# Altium schematic sheet PA_Channel.SchDoc: RF Channel
size 420 x 297 mm; Author: G.K.; CompanyName: WUT; DrawnBy: G.K.; Organization: WUT ISE; Address1: Warsaw Univeristy of Technology; Address2: Nowowiejska 15/19; Revision: -; SheetNumber: -; SheetTotal: -; EDA_Number: ARTIQ; Projet: 8 Channel RF Power Amplifier; ModifiedBy: -; CreateDate: XX/XX/XXXX; CheckedDate: -; Title2: Power supply & protection; DivGrp: ISE; Designer: G.K.; ModifiedDate: -; ProjectName: 8 Channel RF Power Amplifier
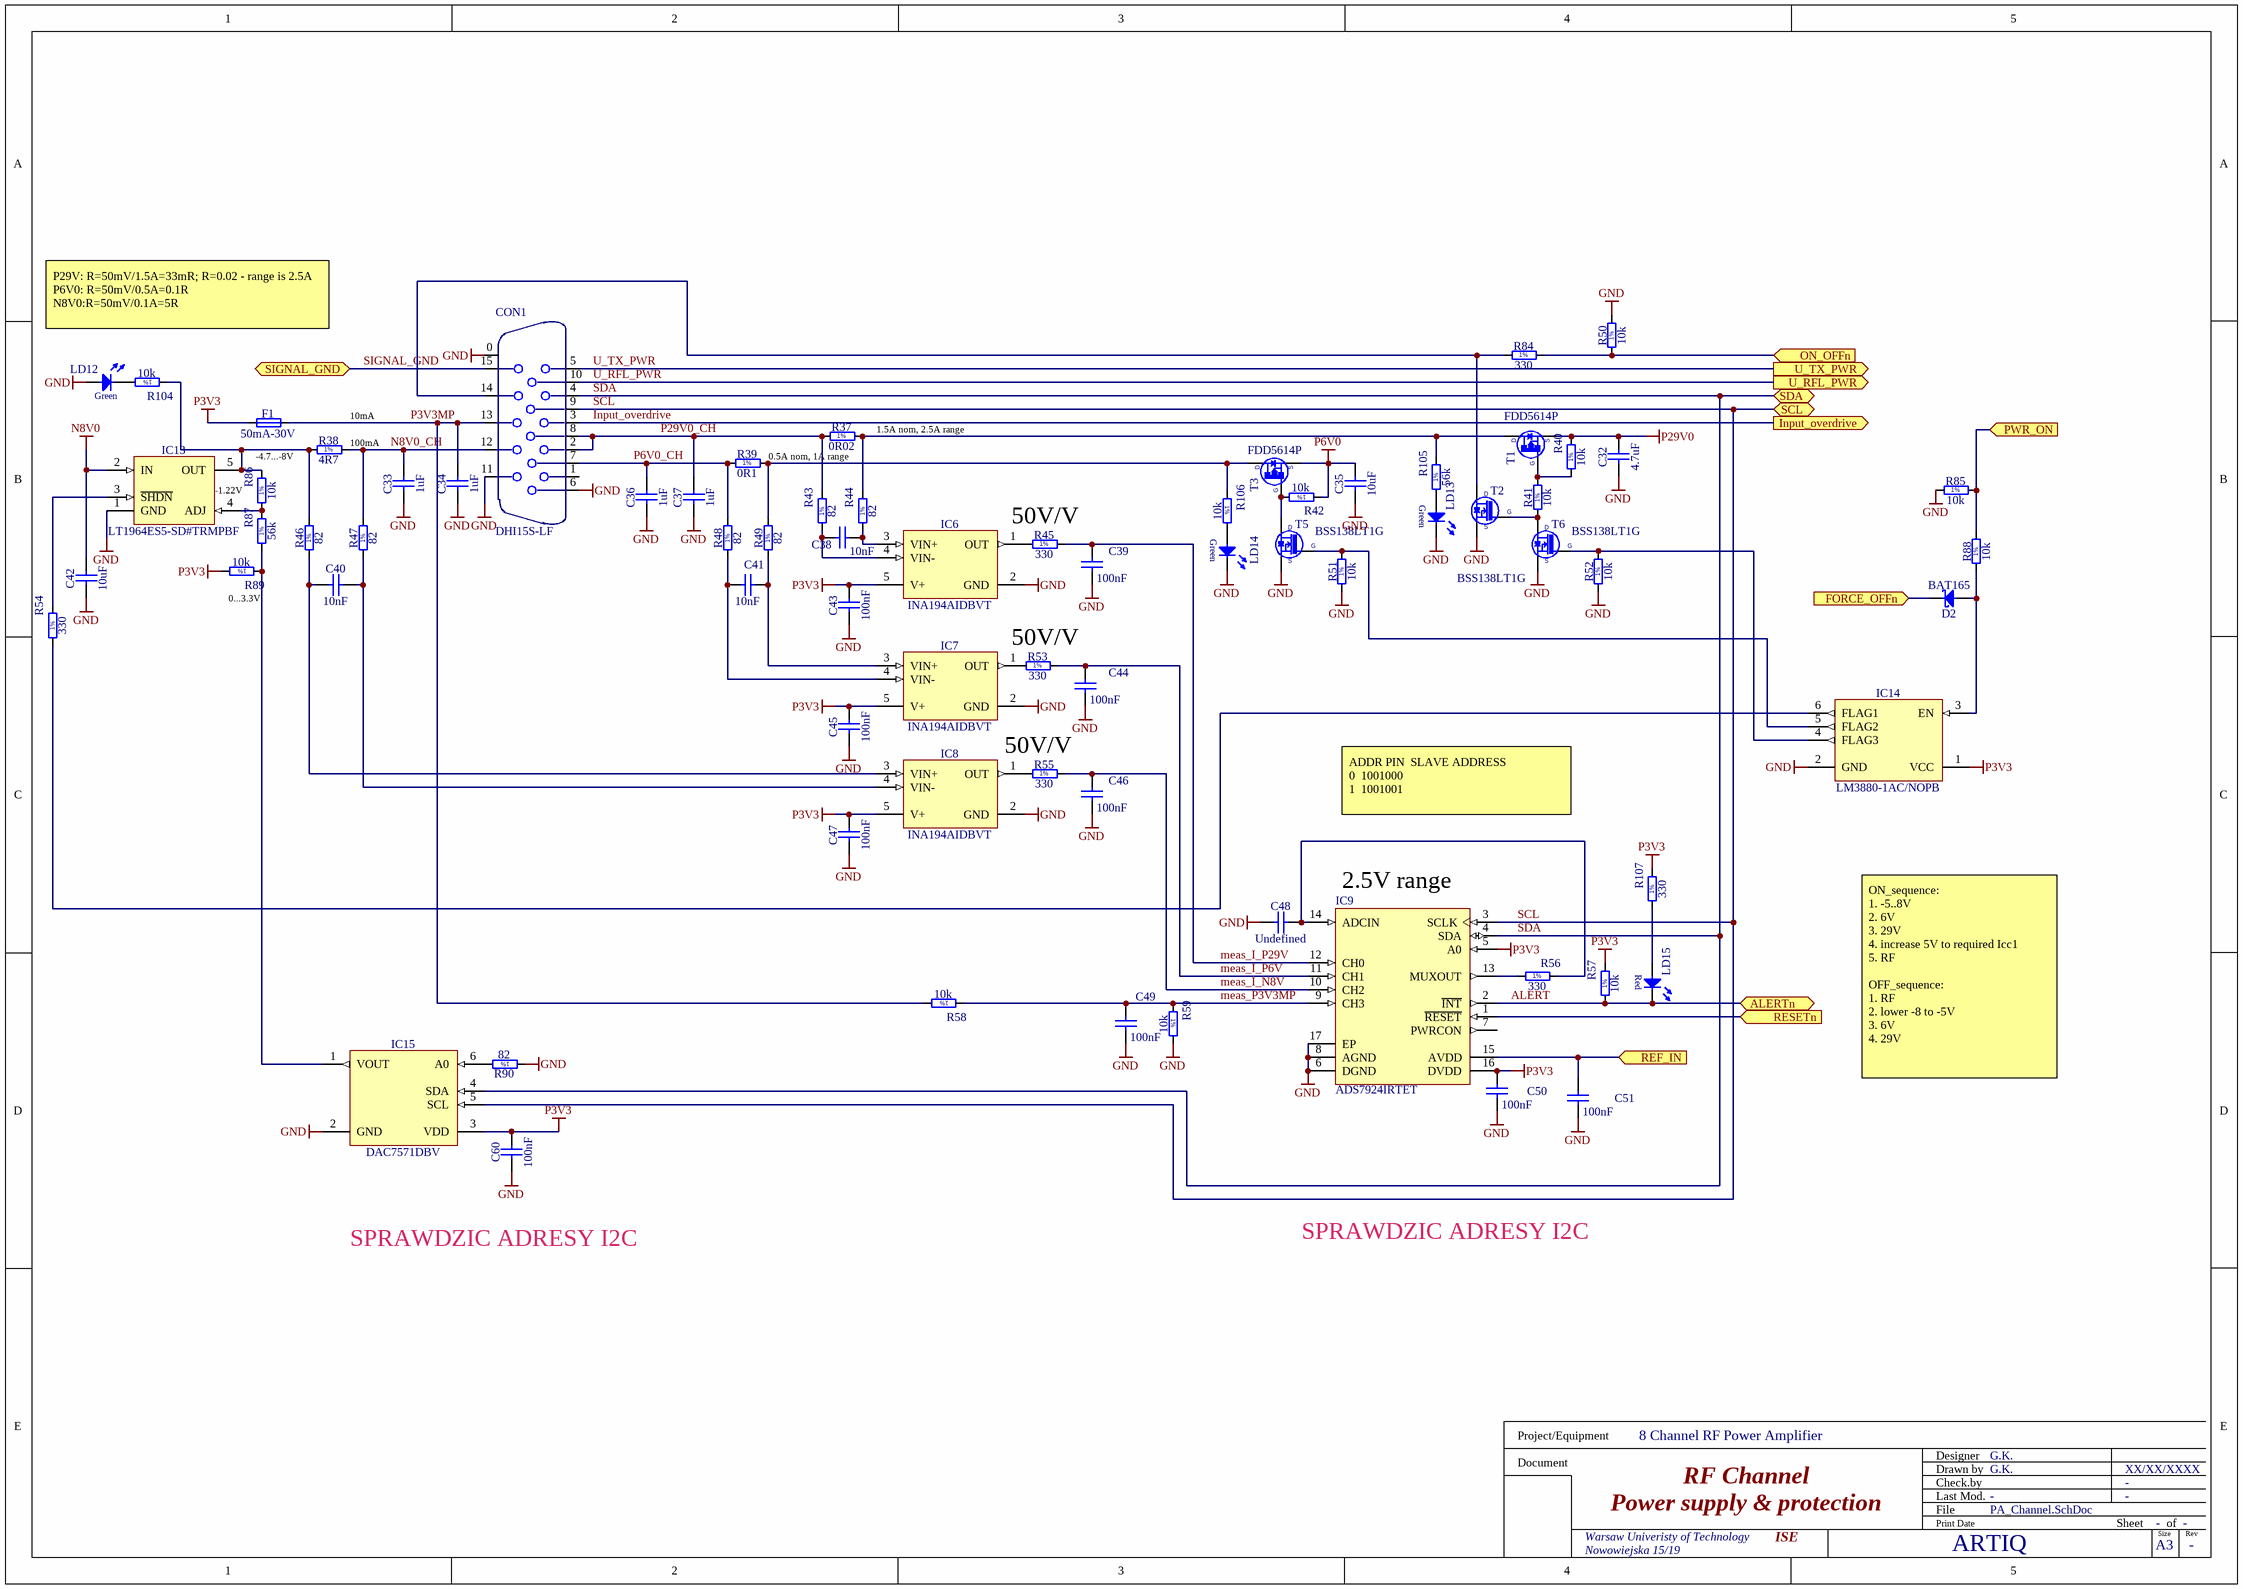
[diagram p0: PA_Channel.SchDoc]

## Parts
C32  4.7uF  [CAPC3216X180N]
C33  1uF  [CAPC2012X110N]
C34  1uF  [CAPC2012X110N]
C35  10uF  [CAPC3216X140N]
C36  1uF  [CAPC2012X110N]
C37  1uF  [CAPC2012X110N]
C38  10nF  [CAPC1608X87N]
C39  100nF  [CAPC1005X55N]
C40  10nF  [CAPC1608X87N]
C41  10nF  [CAPC1608X87N]
C42  10uF  [CAPC3216X140N]
C43  100nF  [CAPC1005X55N]
C44  100nF  [CAPC1005X55N]
C45  100nF  [CAPC1005X55N]
C46  100nF  [CAPC1005X55N]
C47  100nF  [CAPC1005X55N]
C48  Undefined  [CAPC1005X55N]
C49  100nF  [CAPC1005X55N]
C50  100nF  [CAPC1005X55N]
C51  100nF  [CAPC1005X55N]
C60  100nF  [CAPC1005X55N]
CON1  DHI15S-LF  [DB15_HD_V_DHI15S-LF]
D2  BAT165  [SOD2512X110N]
F1  50mA-30V  [FUSRC3226X85N]
IC6  INA194AIDBVT  [SOT95P280X145-5N]
IC7  INA194AIDBVT  [SOT95P280X145-5N]
IC8  INA194AIDBVT  [SOT95P280X145-5N]
IC9  ADS7924IRTET  [TI-RTE16-1700X1700TP_V]
IC13  LT1964ES5-SD#TRMPBF  [SOT95P280X100-5N]
IC14  LM3880-1AC/NOPB  [SOT95P280X145-6N]
IC15  DAC7571DBV  [SOT95P280X145-6N]
LD12  Green  [LED_OSRAM_LGL29K]  (value not drawn)
LD13  Green  [LED_OSRAM_LGL29K]  (value not drawn)
LD14  Green  [LED_OSRAM_LGL29K]  (value not drawn)
LD15  Super Red  [LED_OSRAM_LS Q976]  (value not drawn)
R37  0R02  [RESC3216X80N]
R38  4R7  [RESC3216X65N]
R39  0R1  [RESC3216X65N]
R40  10k  [RESC1005X40N]
R41  10k  [RESC1005X40N]
R42  10k  [RESC1005X40N]
R43  82  [RESC1005X40N]
R44  82  [RESC1005X40N]
R45  330  [RESC1608X55N]
R46  82  [RESC1005X40N]
R47  82  [RESC1005X40N]
R48  82  [RESC1005X40N]
R49  82  [RESC1005X40N]
R50  10k  [RESC1005X40N]
R51  10k  [RESC1005X40N]
R52  10k  [RESC1005X40N]
R53  330  [RESC1608X55N]
R54  330  [RESC1608X55N]
R55  330  [RESC1608X55N]
R56  330  [RESC1608X55N]
R57  10k  [RESC1005X40N]
R58  10k  [RESC1005X40N]
R59  10k  [RESC1005X40N]
R84  330  [RESC1608X55N]
R85  10k  [RESC1005X40N]
R86  10k  [RESC1005X40N]
R87  56k  [RESC1608X55N]
R88  10k  [RESC1005X40N]
R89  10k  [RESC1005X40N]
R90  82  [RESC1005X40N]
R104  10k  [RESC1005X40N]
R105  56k  [RESC1608X55N]
R106  10k  [RESC1005X40N]
R107  330  [RESC1608X55N]
T1  FDD5614P  [TO228P991X238-3N-R546X521]
T2  BSS138LT1G  [SOT95P240X110-3N]
T3  FDD5614P  [TO228P991X238-3N-R546X521]
T5  BSS138LT1G  [SOT95P240X110-3N]
T6  BSS138LT1G  [SOT95P240X110-3N]

## Ports
ALERTn (bidir), FORCE_OFFn (in), Input_overdrive (out), ON_OFFn (in), PWR_ON (in), REF_IN (in), RESETn (in), SCL (bidir), SDA (bidir), SIGNAL_GND (bidir), U_RFL_PWR (out), U_TX_PWR (out)

## Nets
GND: C32.1 C33.1 C34.1 C35.1 C36.1 C37.1 C39.2 C42.1 C43.1 C44.2 C45.1 C46.2 C47.1 C48.1 C49.2 C50.2 C51.2 C60.1 CON1.0 CON1.6 CON1.11 IC6.2(GND) IC7.2(GND) IC8.2(GND) IC9.6(DGND) IC9.8(AGND) IC9.17(EP) IC13.1(GND) IC14.2(GND) IC15.2(GND) LD12.2(A) LD13.1(C) LD14.1(C) R50.2 R51.1 R52.1 R59.2 R85.1 R90.1 T2.2(S) T5.2(S) T6.2(S)
N8V0: C42.2 IC13.2(IN)
P3V3: C43.2 C45.2 C47.2 C50.1 C60.2 F1.1 IC6.5(V+) IC7.5(V+) IC8.5(V+) IC9.5(A0) IC9.16(DVDD) IC14.1(VCC) IC15.3(VDD) R57.2 R89.2 R107.2
P6V0: C35.2 R42.1 T3.2(S)
P29V0: C32.2 R40.2 T1.2(S)
ALERT: IC9.2(~{INT}) LD15.1(C) R57.1 ; port ALERTn
FORCE_OFFn: D2.1(C) ; port FORCE_OFFn
Input_overdrive: CON1.3 ; port Input_overdrive
meas_I_N8V: C46.1 IC9.10(CH2) R55.2
meas_I_P6V: C44.1 IC9.11(CH1) R53.2
meas_I_P29V: C39.1 IC9.12(CH0) R45.2
meas_P3V3MP: C49.1 IC9.9(CH3) R58.1 R59.1
N8V0_CH: C33.2 CON1.12 R38.2 R47.2
ON_OFFn: R50.1 R84.2 ; port ON_OFFn
P3V3MP: C34.2 CON1.13 F1.2 R58.2
P6V0_CH: C36.2 CON1.7 R39.1 R48.2
P29V0_CH: C37.2 CON1.2 CON1.8 R37.1 R43.2
PWR_ON: R85.2 R88.2 ; port PWR_ON
REF_IN: C51.1 IC9.15(AVDD) ; port REF_IN
RESETn: IC9.1(~{RESET}) ; port RESETn
SCL: CON1.9 IC9.3(SCLK) IC15.5(SCL) ; port SCL
SDA: CON1.4 IC9.4(SDA) IC15.4(SDA) ; port SDA
SIGNAL_GND: CON1.15 ; port SIGNAL_GND
U_RFL_PWR: CON1.10 ; port U_RFL_PWR
U_TX_PWR: CON1.5 ; port U_TX_PWR
NetC38_1: C38.1 IC6.4(VIN-) R43.1
NetC38_2: C38.2 IC6.3(VIN+) R44.1
NetC40_1: C40.1 IC8.3(VIN+) R46.1
NetC40_2: C40.2 IC8.4(VIN-) R47.1
NetC41_1: C41.1 IC7.4(VIN-) R48.1
NetC41_2: C41.2 IC7.3(VIN+) R49.1
NetC48_2: C48.2 IC9.14(ADCIN) R56.2
NetCON1_14: CON1.14 R84.1 T2.3(D)
NetD2_2: D2.2(A) IC14.3(EN) R88.1
NetIC6_1: IC6.1(OUT) R45.1
NetIC8_1: IC8.1(OUT) R55.1
NetIC9_13: IC9.13(MUXOUT) R56.1
NetIC13_3: IC13.3(~{SHDN}) R54.2
NetIC13_4: IC13.4(ADJ) R86.1 R87.2
NetIC13_5: IC13.5(OUT) R38.1 R46.2 R86.2 R104.1
NetIC14_4: IC14.4(FLAG3) R52.2 T6.1(G)
NetIC14_5: IC14.5(FLAG2) R51.2 T5.1(G)
NetIC14_6: IC14.6(FLAG1) R54.1
NetIC15_1: IC15.1(VOUT) R87.1 R89.1
NetIC15_6: IC15.6(A0) R90.2
NetLD12_1: LD12.1(C) R104.2
NetLD13_2: LD13.2(A) R105.1
NetLD14_2: LD14.2(A) R106.2
NetLD15_2: LD15.2(A) R107.1
NetR37_2: R37.2 R44.2 R105.2 T1.3(D)
NetR39_2: R39.2 R49.2 R106.1 T3.3(D)
NetR40_1: R40.1 R41.2 T1.1(G)
NetR41_1: R41.1 T2.1(G) T6.3(D)
NetR42_2: R42.2 T3.1(G) T5.3(D)

Not connected (* = marked no-connect by the designer): CON1 1; IC7 1(OUT); IC9 7(PWRCON); R53 1

## Notes on the sheet
- P29V: R=50mV/1.5A=33mR; R=0.02 - range is 2.5A
  P6V0: R=50mV/0.5A=0.1R
  N8V0:R=50mV/0.1A=5R
- -4.7...-8V
- (near R38) 100mA
- (near R38) 10mA
- 0.5A nom, 1A range
- (near R37) 1.5A nom, 2.5A range
- (near IC13) -1.22V
- 50V/V
- (near R89) 0...3.3V
- ADDR PIN 	SLAVE ADDRESS
  0		1001000
  1		1001001
- (near IC9) 2.5V range
- ON_sequence:
  1. -5..8V
  2. 6V
  3. 29V
  4. increase 5V to required Icc1
  5. RF
  OFF_sequence:
  1. RF
  2. lower -8 to -5V
  3. 6V
  4. 29V
- SPRAWDZIC ADRESY I2C
- Project/Equipment
- Document
- Designer
- Drawn by
- Check.by
- File
- Last Mod.
- Print Date
- Sheet
- Size
- A3
- of
- Rev
- (in symbol LED_OSRAM_LS Q976-NR-1) Red
- (in symbol R0402_10K_1%_0.0625W_100PPM) 1%
- (in symbol R0402_82R_1%_0.0625W_100PPM) 1%
- (in symbol R0603_56K_1%_0.1W_100PPM) 1%
- (in symbol R0603_330R_1%_0.1W_100PPM) 1%
- (in symbol R1206_0R1_1%_0.25W_100PPM_YAGEO_PT) 1%
- (in symbol R1206_0R02_1%_1W_150PPM) 1%
- (in symbol R1206_4R7_1%_0.25W_200PPM) 1%

## Library data of the parts
C32 = CC1206_4.7UF_50V_+80%-20%_Y5V: Non-polarised capacitor; Part Description: SMD Multilayer Chip Ceramic Capacitor; Manufacturer: GENERIC; Manufacturer1 Part Number: GRM31CF51H475ZA01L; Voltage: 50V; TC: Y5V; Part Number: CC1206_4.7UF_50V_+80%-20%_Y5V; Component Kind: Standard; Component Type: Standard; Pin Count: 2; Value: 4.7uF; Status: Preferred; Tolerance: +80%-20%; Manufacturer Part Number: CC1206_4.7UF_50V_+80%-20%_Y5V; Case: 1206; Mounted: Yes; Socket: No; SMD: Yes; Sense: No; Manufacturer1 Example: MURATA; Manufacturer1 ComponentHeight: 1.8mm; HelpURL: \\cern.ch\dfs\Applications\Altium\Datasheets\CC1206_MURATA_GRM31CF51H475ZA01L.pdf; Author: CERN DEM JLC; CreateDate: 20.06.2012; LatestRevisionDate: 20.06.2012
C33 C34 C36 C37 = CC0805_1UF_50V_10%_X7R: Non-polarised capacitor; Part Description: SMD Multilayer Chip Ceramic Capacitor; Manufacturer: GENERIC; Manufacturer1 Part Number: C0805C105K5RACTU; Voltage: 50V; TC: X7R; Tolerance: ±10%; Part Number: CC0805_1UF_50V_10%_X7R; Component Kind: Standard; Component Type: Standard; Pin Count: 2; Value: 1uF; Status: Preferred; Manufacturer Part Number: CC0805_1UF_50V_10%_X7R; Case: 0805; Mounted: Yes; Socket: No; SMD: Yes; Sense: No; Manufacturer1 Example: KEMET; Manufacturer1 ComponentHeight: 1.1mm; HelpURL: \\cern.ch\dfs\Applications\Altium\Datasheets\CC0805_X7R_KEMET.pdf; Author: CERN DEM JLC; CreateDate: 04.12.2013; LatestRevisionDate: 04.12.2013
C35 C42 = CC1206_10UF_16V_10%_X7R: Non-polarised capacitor; Part Description: SMD Multilayer Chip Ceramic Capacitor; Manufacturer: GENERIC; Manufacturer1 Part Number: C1206C106K4RAC; Voltage: 16V; TC: X7R; Tolerance: ±10%; Part Number: CC1206_10UF_16V_10%_X7R; Component Kind: Standard; Component Type: Standard; Pin Count: 2; Value: 10uF; Status: Preferred; Manufacturer Part Number: CC1206_10uF_16V_10%_X7R; Case: 1206; Mounted: Yes; Socket: No; SMD: Yes; Sense: No; Manufacturer1 Example: KEMET; Manufacturer1 ComponentHeight: 1.8mm; HelpURL: \\cern.ch\dfs\Applications\Altium\Datasheets\CC1206_X7R_KEMET.pdf; Author: CERN DEM JLC; CreateDate: 28.04.2009; LatestRevisionDate: 28.04.2009
C38 C40 C41 = CC0603_10NF_50V_5%_C0G: Non-polarised capacitor; Part Description: SMD Multilayer Chip Ceramic Capacitor; Manufacturer: GENERIC; Manufacturer1 Part Number: C1608C0G1H103J080AA; Voltage: 50V; TC: C0G/NP0; Tolerance: ±5%; Part Number: CC0603_10NF_50V_5%_C0G; Component Kind: Standard; Component Type: Standard; Pin Count: 2; Value: 10nF; Status: Preferred; Manufacturer Part Number: CC0603_10NF_50V_5%_C0G; Case: 0603; Mounted: Yes; Socket: No; SMD: Yes; Sense: No; Manufacturer1 Example: TDK; Manufacturer1 ComponentHeight: 0.9mm; HelpURL: \\cern.ch\dfs\Applications\Altium\Datasheets\CC0603_C0G_TDK_C.pdf; Author: CERN DEM JLC; CreateDate: 10.12.2014; LatestRevisionDate: 10.12.2014
C39 C44 C46 C49-C51 = CC0402_100NF_16V_10%_X7R: Non-polarised capacitor; Part Description: SMD Multilayer Chip Ceramic Capacitor; Manufacturer: GENERIC; Manufacturer1 Part Number: GRM155R71C104KA88D; Voltage: 16V; TC: X7R; Tolerance: ±10%; Table: Capacitors SMD; Part Number: CC0402_100NF_16V_10%_X7R; Component Kind: Standard; Component Type: Standard; Pin Count: 2; Value: 100nF; Status: Not Recommended; Manufacturer Part Number: CC0402_100NF_16V_10%_X7R; Case: 0402; Mounted: Yes; Socket: No; SMD: Yes; Manufacturer1 Example: MURATA; Manufacturer1 ComponentHeight: 0.55mm; HelpURL: \\cern.ch\dfs\Applications\Altium\Datasheets\CC0402_X7R_MURATA_GRM.pdf; Author: CERN DEM JLC; CreateDate: 2013-12-05; LatestRevisionDate: 2007-12-03
C43 C45 C47 C60 = CC0402_100NF_16V_10%_X7R: Non-polarised capacitor; Part Description: SMD Multilayer Chip Ceramic Capacitor; Manufacturer: GENERIC; Manufacturer1 Part Number: GRM155R71C104KA88D; Voltage: 16V; TC: X7R; Tolerance: ±10%; Part Number: CC0402_100NF_16V_10%_X7R; Component Kind: Standard; Component Type: Standard; Pin Count: 2; Value: 100nF; Status: Not Recommended; Manufacturer Part Number: CC0402_100NF_16V_10%_X7R; Case: 0402; Mounted: Yes; Socket: No; SMD: Yes; Sense: No; Manufacturer1 Example: MURATA; Manufacturer1 ComponentHeight: 0.55mm; HelpURL: \\cern.ch\dfs\Applications\Altium\Datasheets\CC0402_X7R_MURATA_GRM.pdf; Author: CERN DEM JLC; CreateDate: 05.12.2013; LatestRevisionDate: 03.12.2007
C48 = CC0402_NO-VALUE: Non-polarised capacitor; Part Description: Reserved Footprint For 0402(1005) Chip Ceramic Capacitor; Mounted: No; Part Number: CC0402_NO-VALUE; Component Kind: Standard; Component Type: Standard; Pin Count: 2; Value: Undefined; Status: None; Manufacturer: Undefined; Manufacturer Part Number: CC0402_NO-VALUE; Case: 0402; Socket: No; SMD: Yes; Sense: No; Manufacturer1 ComponentHeight: 0.55mm; HelpURL: Undefined; Author: CERN DEM JLC; CreateDate: 14.01.2014; LatestRevisionDate: 14.01.2014
CON1 = CON_DB15HD_F_V: High Density D-SUB (Maritex)
D2 = BAT165: Schottky Diode; Part Description: Medium Power AF Schottky Diode; Manufacturer: INFINEON; Voltage: 40V; Power: 750mA; PressFit: No; Bonding: No; Part Number: BAT165; Component Kind: Standard; Component Type: Standard; Device: BAT165; PackageDescription: Small Outline Diode Flat Lead (SOD-323), 1.70mm W X 1.25mm L X 1.10mm H body,  IPC Medium Density; Manufacturer Part Number: BAT165; Pin Count: 2; Case: SOD323; Mounted: Yes; Socket: No; SMD: Yes; Sense: No; ComponentHeight: 1.1mm; HelpURL: \\cern.ch\dfs\Applications\Altium\Datasheets\BAT165.pdf; Author: CERN DEM JLC; CreateDate: 12.11.2014; LatestRevisionDate: 12.11.2014
F1 = FUSR1210_TYCO-MICROSMD005F: Fuse; Part Description: PolySwitch® PTC Overcurrent Protection Device; Manufacturer: TYCO ELECTRONICS; PressFit: No; Part Number: FUSR1210_TYCO-MICROSMD005F; Component Kind: Standard; Component Type: Standard; Pin Count: 2; PackageDescription: Chip Resettable Fuse, 2-Leads, Body 3.2mm x 2.6mm, IPC Medium Density; Family: Fuses Resettable; Mounted: Yes; Socket: No; SMD: Yes; Sense: No; Value: 50mA-30V; Manufacturer Part Number: microSMD005F; ComponentHeight: 0.85mm; HelpURL: \\cern.ch\dfs\Applications\Altium\Datasheets\FUSR_TYCO_microSMD005F.pdf; Author: CERN DEM JLC; CreateDate: 14.12.2010; LatestRevisionDate: 14.12.2010
IC6-IC8 = INA194AIDBVT: Current Shunt Monitor -16V to +80V Common-Mode Range; Manufacturer: TEXAS INSTRUMENTS; PressFit: No; Bonding: No; Part Number: INA194AIDBVT; Component Kind: Standard; Component Type: Standard; Device: INA194AIDBVT; PackageDescription: SOT, 0.95mm pitch; 5 pin, 1.60mm W X 2.90mm L X 1.45mm H body, IPC Medium Density; Part Description: Current Shunt Monitor -16V to +80V Common-Mode Range; Manufacturer Part Number: INA194AIDBVT; Pin Count: 5; Case: SOT23-5; Mounted: Yes; Socket: No; SMD: Yes; Sense: No; ComponentHeight: 1.45mm; Author: CERN DEM JLC; HelpURL: \\cern.ch\dfs\Applications\Altium\Datasheets\INA194AIDBVT.pdf; CreateDate: 10.05.2010; LatestRevisionDate: 10.05.2010
IC9 = CMP-0003-02162-1: 12-Bit, 4-Channel Mux Input SAR ADC with Intelligent System Power Control, -40 to 85 degC, 16-pin QFN (RTE16), Green (RoHS & no Sb/Br); Manufacturer: Texas Instruments; Interface: Serial I2C; Resolution(Bits): 12; Sample Rate (max)(SPS): 100k; Digital Supply(Max)(V): 5.5; INL(Max)(+/-LSB): 1.5; # Input Channels: 4; Analog Voltage AV/DD(Min)(V): 2.2; SubFamily: Precision ADC (<=10MSPS); Digital Supply(Min)(V): 1.65; ComponentLink1Description: Manufacturer URL; DatasheetVersion: SBAS482A; ComponentLink3Description: Package Specification; ComponentLink2Description: Datasheet; PackageVersion: 4205254/D, 01/2011; Code_JEDEC: MO-220; Mounting Technology: Surface Mount; Eco-Plan: Green (RoHS & no Sb/Br); PackageReference: RTE16-1700X1700TP; PartNumber: ADS7924IRTET; Analog Voltage AV/DD(Max)(V): 5.5; ComponentLink3URL: http://www.ti.com/litv/pdf/mpqf149c; ComponentLink2URL: http://www.ti.com/general/docs/lit/getliterature.tsp?genericPartNumber=ADS7924&fileType=pdf; Architecture: SAR; ComponentLink1URL: http://www.ti.com/; PackageDescription: 16-Pin Plastic Flat Pack, Body 3 x 3 mm, Pitch 0.5 mm
IC13 = LT1964ES5-SD#TRMPBF: 200mA, Low Noise, Low Dropout Negative Micropower Regulator; Part Description: -1.22V to -20V, 200mA, Low Noise, Low Dropout Negative Micropower Regulator; Manufacturer: LINEAR TECHNOLOGY; PressFit: No; Bonding: No; Part Number: LT1964ES5-SD#TRMPBF; Component Kind: Standard; Component Type: Standard; Device: LT1964ES5-SD#TRMPBF; PackageDescription: SOT23, 0.95mm pitch; 5 pin, 1.75mm W X 3.00mm L, IPC Medium Density; Manufacturer Part Number: LT1964ES5-SD#TRMPBF; Pin Count: 5; Case: SOT23-5; Mounted: Yes; Socket: No; SMD: Yes; Sense: No; ComponentHeight: 1mm; HelpURL: \\cern.ch\dfs\Applications\Altium\Datasheets\LT1964ES5-SD#TRMPBF.pdf; Author: CERN DEM JLC; CreateDate: 05.05.2009; LatestRevisionDate: 05.05.2009
IC14 = LM3880-1AC/NOPB: Simple Power Sequencer; Part Description: Simple Power Sequencer, Power UP : 1 2 3, Power Down 3 2 1, Timing Designator 60ms; Manufacturer: TEXAS INSTRUMENTS; PressFit: No; Bonding: No; Part Number: LM3880-1AC/NOPB; Component Kind: Standard; Component Type: Standard; Device: LM3880-1AC/NOPB; PackageDescription: SOT23, 6-Leads, Body 1.6x3.0mm, Pitch 0.95mm, IPC Medium Density; Manufacturer Part Number: LM3880-1AC/NOPB; Pin Count: 6; Case: SOT23-6; Mounted: Yes; Socket: No; SMD: Yes; Sense: No; ComponentHeight: 1.45mm; Author: CERN DEM MR; HelpURL: \\cern.ch\dfs\Applications\Altium\Datasheets\LM3880-1AC-NOPB.pdf; CreateDate: 17.03.2016; LatestRevisionDate: 17.03.2016
IC15 = DAC7571DBV: +2.7 V to +5.5 V, I2C Interface (Receive Only), Voltage Output, 12-Bit Digital-To-Analog Converter; Manufacturer: TEXAS INSTRUMENTS; PressFit: No; Bonding: No; Part Number: DAC7571DBV; Component Kind: Standard; Component Type: Standard; Device: DAC7571DBV; PackageDescription: SOT23, 6-Leads, Body 1.6x3.0mm, Pitch 0.95mm, IPC Medium Density; Part Description: +2.7 V to +5.5 V, I2C Interface (Receive Only), Voltage Output, 12-Bit Digital-To-Analog Converter; Manufacturer Part Number: DAC7571DBV; Pin Count: 6; Case: SOT23-6; Mounted: Yes; Socket: No; SMD: Yes; Sense: No; ComponentHeight: 1.45mm; Author: CERN DEM MR; HelpURL: \\cern.ch\dfs\Applications\Altium\Datasheets\DAC7571DBV.pdf; CreateDate: 07.07.2016; LatestRevisionDate: 07.07.2016
LD12-LD14 = LED_OSRAM_LG L29K-G2J1-24-Z: LED Green 1C 2A; Part Description: Surface Mount Green LED (0603 Case); Manufacturer: OSRAM; PressFit: No; Bonding: No; Part Number: LED_OSRAM_LG L29K-G2J1-24-Z; Component Kind: Standard; Component Type: Standard; Color: Green; PackageDescription: Green Chip LED, 2-Leads, Body 1.7x0.8mm, IPC Medium Density; Manufacturer Part Number: LG L29K-G2J1-24-Z; Pin Count: 2; Case: 0603; Mounted: Yes; Socket: No; SMD: Yes; Sense: No; ComponentHeight: 0.67mm; HelpURL: \\cern.ch\dfs\Applications\Altium\Datasheets\LED_OSRAM_LGL29K.pdf; Author: CERN DEM JLC; CreateDate: 24.04.2012; LatestRevisionDate: 24.04.2012
LD15 = LED_OSRAM_LS Q976-NR-1: LED Red 1C 2A; Part Description: CHIPLED Super Red LED (0603 Case); Manufacturer: OSRAM; PressFit: No; Bonding: No; Part Number: LED_OSRAM_LS Q976-NR-1; Component Kind: Standard; Component Type: Standard; Color: Super Red; PackageDescription: Chip Super Red LED, 2-Leads, Body 1.6x0.8mm; Manufacturer Part Number: LS Q976-NR-1; Pin Count: 2; Case: 0806; Mounted: Yes; Socket: No; SMD: Yes; Sense: No; ComponentHeight: 0.8mm; HelpURL: \\cern.ch\dfs\Applications\Altium\Datasheets\LED_OSRAM_LS Q976-NR-1.pdf; Author: CERN DEM JLC; CreateDate: 12.11.2014; LatestRevisionDate: 12.11.2014
R37 = R1206_0R02_1%_1W_150PPM: Resistor - 1%; Part Description: Low Value Thick Film Chip Resistor; Manufacturer: PANASONIC; Manufacturer Part Number: ERJ8BWFR020V; Power: 1W; TC: ±150ppm/°C; Part Number: R1206_0R02_1%_1W_150PPM; Component Kind: Standard; Component Type: Standard; Pin Count: 2; Value: 0R02; Status: Not recommended; Tolerance: ±1%; Case: 1206; Mounted: Yes; Sense: No; Socket: No; SMD: Yes; ComponentHeight: 0.8mm; HelpURL: \\cern.ch\dfs\Applications\Altium\Datasheets\R1206_PANASONIC_ERJ8BW.pdf; Author: CERN DEM JLC; CreateDate: 03.09.2012; LatestRevisionDate: 03.09.2012
R38 = R1206_4R7_1%_0.25W_200PPM: Resistor - 1%; Part Description: General Purpose Thick Film Chip Resistor; Manufacturer: GENERIC; Manufacturer1 Part Number: 232272464708L or RC1206FR-074R7L; Power: 0.25W; TC: ±200ppm/°C; Part Number: R1206_4R7_1%_0.25W_200PPM; Component Kind: Standard; Component Type: Standard; Pin Count: 2; Value: 4R7; Status: Preferred; Tolerance: ±1%; Manufacturer Part Number: R1206_4R7_1%_0.25W_200PPM; Case: 1206; Mounted: Yes; Sense: No; Socket: No; SMD: Yes; Manufacturer1 Example: YAGEO PHYCOMP; Manufacturer1 ComponentHeight: 0.65mm; HelpURL: \\cern.ch\dfs\Applications\Altium\Datasheets\R1206_Phycomp_RC1206.pdf; Author: CERN DEM JLC; CreateDate: 03.12.2007; LatestRevisionDate: 17.10.2012
R39 = R1206_0R1_1%_0.25W_100PPM_YAGEO_PT: Resistor - 1%; Part Description: Current Sensor, Low TCR Chip Resistor; Manufacturer: YAGEO PHYCOMP; Manufacturer Part Number: PT1206FR-070R1L; Power: 0.25W; TC: ±100ppm/°C; Part Number: R1206_0R1_1%_0.25W_100PPM_YAGEO_PT; Component Kind: Standard; Component Type: Standard; Pin Count: 2; Value: 0R1; Status: None; Tolerance: ±1%; Case: 1206; Mounted: Yes; Sense: No; Socket: No; SMD: Yes; ComponentHeight: 0.65mm; HelpURL: \\cern.ch\dfs\Applications\Altium\Datasheets\R1206_YAGEO_PT.pdf; Author: CERN DEM JMW; CreateDate: 06.07.2015; LatestRevisionDate: 06.07.2015
R40-R42 R50-R52 R57-R59 R85 R86 R88 R89 R104 R106 = R0402_10K_1%_0.0625W_100PPM: Resistor - 1%; Part Description: General Purpose Thick Film Chip Resistor; Manufacturer: GENERIC; Manufacturer1 Part Number: 232270671003L; TC: ±100ppm/°C; Table: Resistors SMD; Part Number: R0402_10K_1%_0.0625W_100PPM; Component Kind: Standard; Component Type: Standard; Pin Count: 2; Value: 10k; Status: Not recommended; Power: 0.0625W; Tolerance: ±1%; Manufacturer Part Number: R0402_10K_1%_0.0625W_100PPM; Case: 0402; Mounted: Yes; Socket: No; SMD: Yes; Manufacturer1 Example: YAGEO PHYCOMP; Manufacturer1 ComponentHeight: 0.4mm; HelpURL: \\cern.ch\dfs\Applications\Altium\Datasheets\R0402_Phycomp_RC0402.pdf; Author: CERN DEM JLC; CreateDate: 2007-12-03; LatestRevisionDate: 2012-10-17
R43 R44 R46-R49 R90 = R0402_82R_1%_0.0625W_100PPM: Resistor - 1%; Part Description: General Purpose Thick Film Chip Resistor; Manufacturer: GENERIC; Manufacturer1 Part Number: 232270678209L; TC: ±100ppm/°C; Part Number: R0402_82R_1%_0.0625W_100PPM; Component Kind: Standard; Component Type: Standard; Pin Count: 2; Value: 82; Status: Not recommended; Power: 0.0625W; Tolerance: ±1%; Manufacturer Part Number: R0402_82R_1%_0.0625W_100PPM; Case: 0402; Mounted: Yes; Sense: No; Socket: No; SMD: Yes; Manufacturer1 Example: YAGEO PHYCOMP; Manufacturer1 ComponentHeight: 0.4mm; HelpURL: \\cern.ch\dfs\Applications\Altium\Datasheets\R0402_Phycomp_RC0402.pdf; Author: CERN DEM JLC; CreateDate: 03.12.2007; LatestRevisionDate: 17.10.2012
R45 R53-R56 R84 R107 = R0603_330R_1%_0.1W_100PPM: Resistor - 1%; Part Description: General Purpose Thick Film Chip Resistor; Manufacturer: GENERIC; Manufacturer1 Part Number: NRC06F3300TRF; Power: 0.1W; TC: ±100ppm/°C; Table: Resistors SMD; Part Number: R0603_330R_1%_0.1W_100PPM; Component Kind: Standard; Component Type: Standard; Pin Count: 2; Value: 330; Status: Preferred; Tolerance: ±1%; Manufacturer Part Number: R0603_330R_1%_0.1W_100PPM; Case: 0603; Mounted: Yes; Socket: No; SMD: Yes; Manufacturer1 Example: NIC COMPONENT; Manufacturer1 ComponentHeight: 0.55mm; HelpURL: \\cern.ch\dfs\Applications\Altium\Datasheets\R0603_NIC_NRC.pdf; Author: CERN DEM JLC; CreateDate: 2007-12-03; LatestRevisionDate: 2008-03-13
R87 R105 = R0603_56K_1%_0.1W_100PPM: Resistor - 1%; Part Description: General Purpose Thick Film Chip Resistor; Manufacturer: GENERIC; Manufacturer1 Part Number: NRC06F5602TRF; Power: 0.1W; TC: ±100ppm/°C; Part Number: R0603_56K_1%_0.1W_100PPM; Component Kind: Standard; Component Type: Standard; Pin Count: 2; Value: 56k; Status: Preferred; Tolerance: ±1%; Manufacturer Part Number: R0603_56K_1%_0.1W_100PPM; Case: 0603; Mounted: Yes; Sense: No; Socket: No; SMD: Yes; Manufacturer1 Example: NIC COMPONENT; Manufacturer1 ComponentHeight: 0.55mm; HelpURL: \\cern.ch\dfs\Applications\Altium\Datasheets\R0603_NIC_NRC.pdf; Author: CERN DEM JLC; CreateDate: 03.12.2007; LatestRevisionDate: 13.03.2008
T1 T3 = FDD5614P: P-CHANNEL MOSFET WITH DIODE; Part Description: -60V -15A P-Channel PowerTrench® MOSFET; Manufacturer: FAIRCHILD SEMICONDUCTOR; PressFit: No; Bonding: No; Part Number: FDD5614P; Component Kind: Standard; Component Type: Standard; Device: FDD5614P; PackageDescription: TO-252AA DPAK TO, 2.28mm pitch; 2 pin,9.905mm L X 6.095mm W X 2.38mm H body, IPC Medium Density; Manufacturer Part Number: FDD5614P; Pin Count: 3; Case: DPAK; Mounted: Yes; Socket: No; SMD: Yes; Sense: No; ComponentHeight: 2.38mm; HelpURL: \\cern.ch\dfs\Applications\Altium\Datasheets\FDD5614P.pdf; Author: CERN DEM JLC; CreateDate: 23.09.2009; LatestRevisionDate: 23.09.2009
T2 T5 T6 = BSS138LT1G: N-CHANNEL MOSFET WITH DIODE; Part Description: 50V 200mA N-Channel Enhancement Mode Field-Effect Transistor; Manufacturer: ON SEMICONDUCTOR; PressFit: No; Bonding: No; Table: Transistors; Part Number: BSS138LT1G; Component Kind: Standard; Component Type: Standard; Device: BSS138LT1G; PackageDescription: SOT23 3-Leads, Pitch 0.95mm - Body 1.4x3mm, IPC Medium Density; Manufacturer Part Number: BSS138LT1G; Pin Count: 3; Case: SOT23-3; Mounted: Yes; Socket: No; SMD: Yes; ComponentHeight: 1.11mm; HelpURL: \\cern.ch\dfs\Applications\Altium\Datasheets\BSS138LT1G.pdf; Author: CERN DEM JLC; CreateDate: 2009-03-23; LatestRevisionDate: 2009-03-23